# EAGLE schematic signal_processing_module (EAGLE 9.6.2)
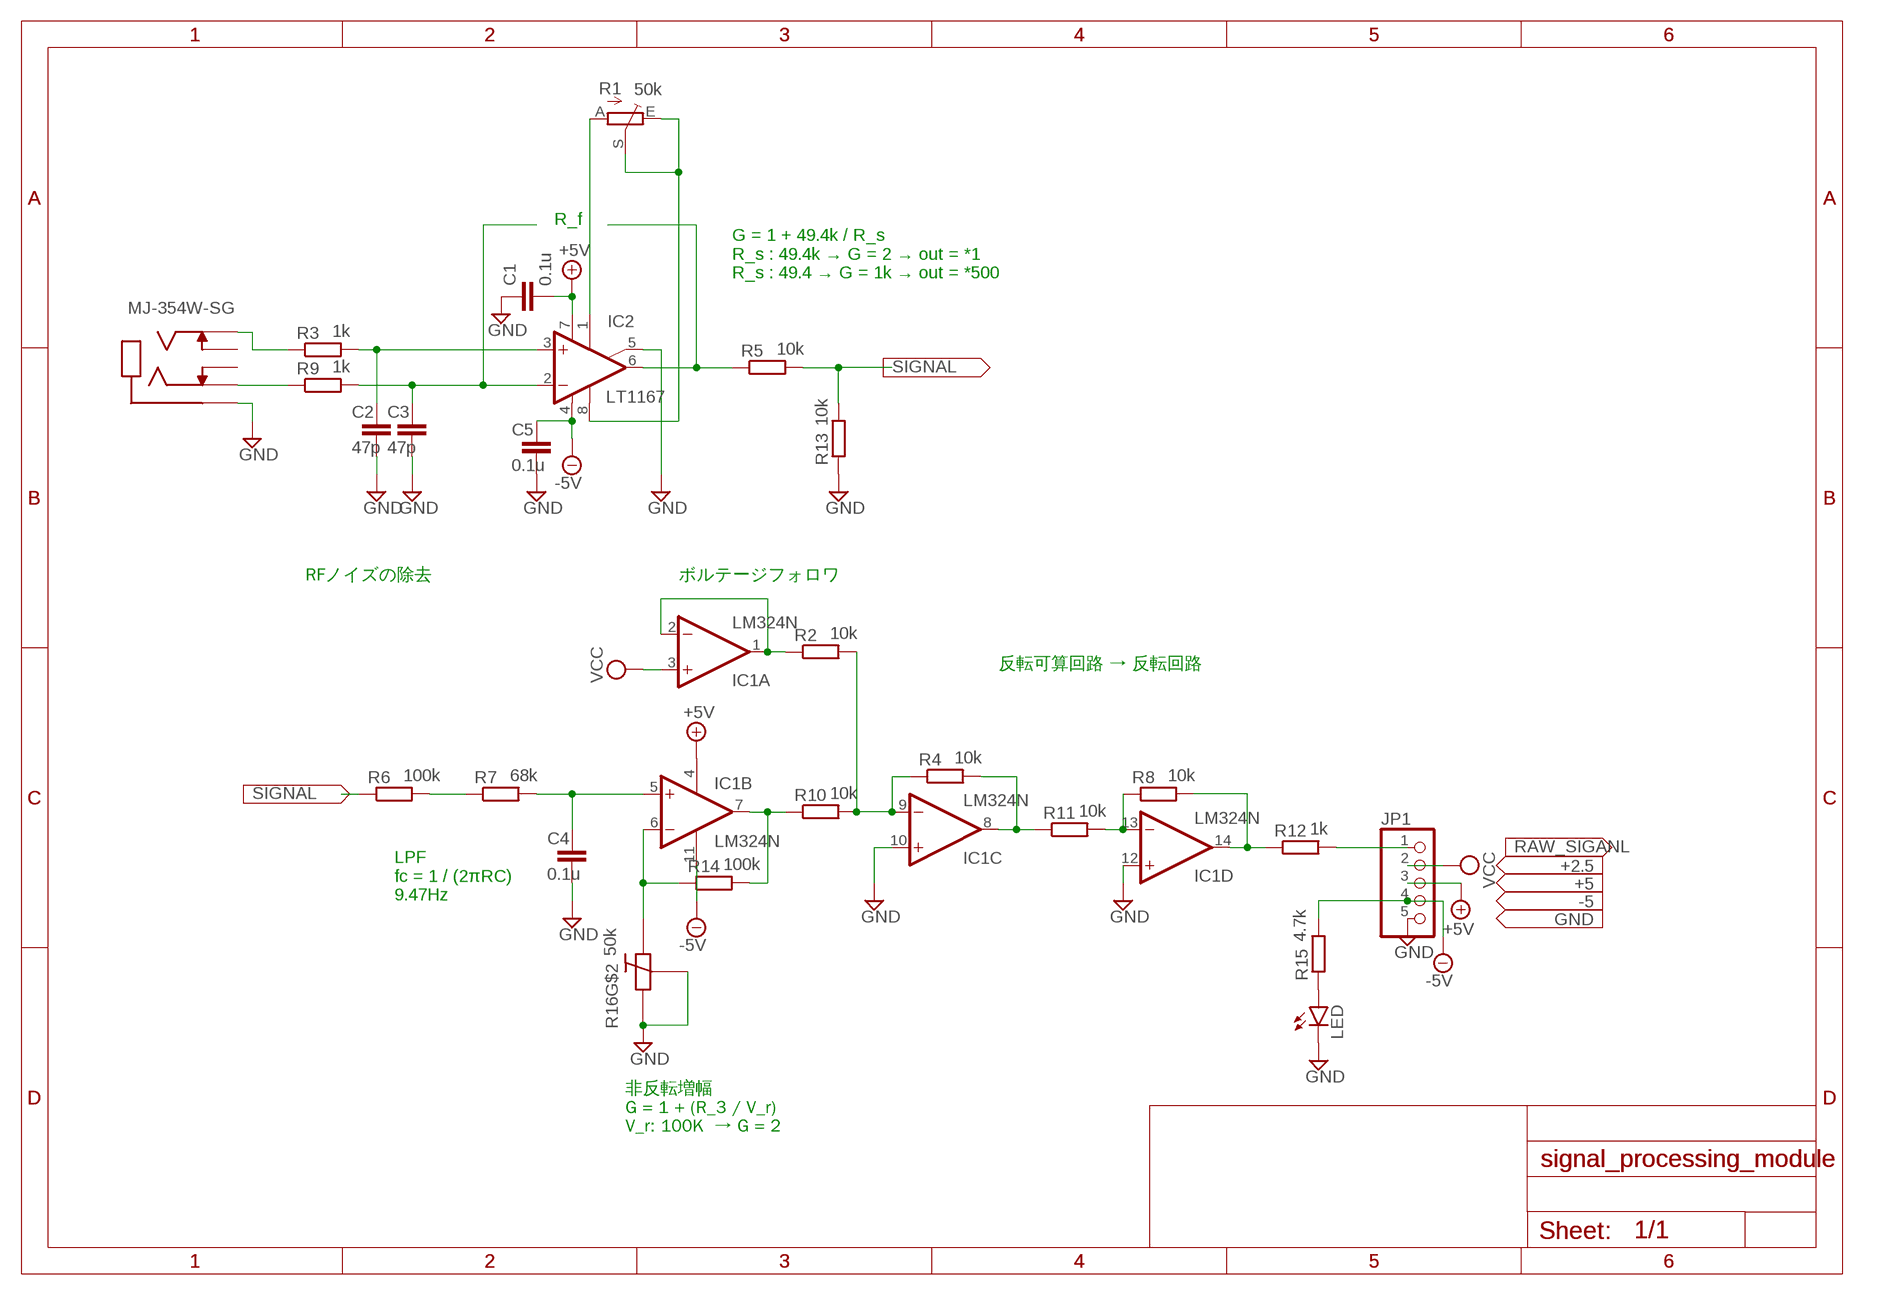
[diagram p0: schematic, sheet 1]

## Parts
C1  0.1u  C-EU025-024X044  [C025-024X044]
C2  47p  C-EU025-024X044  [C025-024X044]
C3  47p  C-EU025-024X044  [C025-024X044]
C4  0.1u  C-EU025-024X044  [C025-024X044]
C5  0.1u  C-EU025-024X044  [C025-024X044]
IC1  LM324N  [DIL14]
IC2  TL061P  [DIL08]
JP1  PINHD-1X5  [1X05]
LED  LED3MM  [LED3MM]
R1  50k  TRIM_EU-RS3  [RS3]
R2  10k  R-EU_0204/7  [0204/7]
R3  1k  R-EU_0204/7  [0204/7]
R4  10k  R-EU_0204/7  [0204/7]
R5  10k  R-EU_0204/7  [0204/7]
R6  100k  R-EU_0204/7  [0204/7]
R7  68k  R-EU_0204/7  [0204/7]
R8  10k  R-EU_0204/7  [0204/7]
R9  1k  R-EU_0204/7  [0204/7]
R10  10k  R-EU_0204/7  [0204/7]
R11  10k  R-EU_0204/7  [0204/7]
R12  1k  R-EU_0204/7  [0204/7]
R13  10k  R-EU_0204/7  [0204/7]
R14  100k  R-EU_0204/7  [0204/7]
R15  4.7k  R-EU_0204/7  [0204/7]
R16  50k  VR_2CH  [2CH_VR]
U$1  MJ-354W-SG-NEW  [MJ-354W-SG]

## Nets
+5V: C1.2 IC1.4(P:V+) IC2.7(V+) JP1.3
-5V: C5.1 IC1.11(P:V-) IC2.4(V-) JP1.4 R15.2
GND: C1.1 C2.2 C3.2 C4.2 C5.2 IC1.10(C:+IN) IC1.12(D:+IN) IC2.5(ON2) JP1.5 LED.K(C) R13.1 R16.P$4 R16.P$5 U$1.P$1
N$1: R9.1 U$1.P$2
N$2: R3.1 U$1.P$4
N$3: C2.1 IC2.3(+IN) R3.2
N$4: C3.1 IC2.2(-IN) R9.2
N$5: IC2.8(OPT) R1.E R1.S
N$6: IC2.6(OUT) R5.1
N$7: IC2.1(ON1) R1.A
N$8: R6.2 R7.1
N$9: IC1.13(D:-IN) R8.1 R11.2
N$10: JP1.1 R12.2
N$11: LED.A R15.1
N$12: IC1.6(B:-IN) R14.1 R16.P$6
N$13: IC1.8(C:OUT) R4.2 R11.1
N$14: IC1.14(D:OUT) R8.2 R12.1
N$15: C4.1 IC1.5(B:+IN) R7.2
N$16: R5.2 R13.2
N$17: R6.1
N$18: IC1.1(A:OUT) IC1.2(A:-IN) R2.1
N$21: IC1.9(C:-IN) R2.2 R4.1 R10.2
RAW_SIGNAL: IC1.7(B:OUT) R10.1 R14.2
VCC: IC1.3(A:+IN) JP1.2
Unconnected: R16.P$1 R16.P$2 R16.P$3 U$1.P$3 U$1.P$5

## Notes on the sheet
- R_f
- G = 1 + 49.4k / R_s
  R_s : 49.4k → G = 2 → out = *1
  R_s : 49.4 → G = 1k → out = *500
- MJ-354W-SG
- LT1167
- RFノイズの除去 | ボルテージフォロワ
- 反転可算回路 → 反転回路
- LPF
  fc = 1 / (2πRC)
  9.47Hz
- 非反転増幅
  G = 1 + (R_3 / V_r)
  V_r: 100K  → G = 2

## Library data of the parts
C1-C5 = rcl:C-EU: CAPACITOR, European symbol; SPICEPREFIX: C
IC1 = linear:LM324: OP AMP
IC2 = linear:TL061: OP AMP
JP1 = pinhead:PINHD-1X5: PIN HEADER
LED = led:LED: LED OSRAM: - CHIPLED LG R971, LG N971, LY N971, LG Q971, LY Q971, LO R971, LY R971 LH N974, LH R974 LS Q976, LO Q976, LY Q976 LO Q996 - Hyper CHIPLED LW Q18S LB Q993, LB Q99A, LB R99A - SideLED LS A670, LO A670, LY A670, LG A670, LP A670 LB A673, LV A673, LT A673, LW A673 LH A674 LY A675 LS A676, LA A676, LO A676, LY A676, LW A676 LS A679, LY A679, LG A679 - Hyper Micro SIDELED® LS Y876, LA Y876, LO Y876, LY Y876 LT Y87S - SmartLED LW L88C, LW L88S LB L89C, LB L89S, LG L890 LS L89K, LO L89K, LY L89K LS L896, LA L896, LO L896, LY L896 - TOPLED LS T670, LO T670, LY T670, LG T670, LP T670 LSG T670, LSP T670, LSY T670, LOP T670, LYG T670 LG T671, LOG T671, LSG T671 LB T673, LV T673, LT T673, LW T673 LH T674 LS T676, LA T676, LO T676, LY T676, LB T676, LH T676, LSB T676, LW T676 LB T67C, LV T67C, LT T67C, LS T67K, LO T67K, LY T67K, LW E67C LS E67B, LA E67B, LO E67B, LY E67B, LB E67C, LV E67C, LT E67C LW T67C LS T679, LY T679, LG T679 LS T770, LO T770, LY T770, LG T770, LP T770 LB T773, LV T773, LT T773, LW T773 LH T774 LS E675, LA E675, LY E675, LS T675 LS T776, LA T776, LO T776, LY T776, LB T776 LHGB T686 LT T68C, LB T68C - Hyper Mini TOPLED® LB M676 - Mini TOPLED Santana® LG M470 LS M47K, LO M47K, LY M47K Source: http://www.osram.convergy.de LUXEON: - LUMILED® LXK2-PW12-R00, LXK2-PW12-S00, LXK2-PW14-U00, LXK2-PW14-V00 LXK2-PM12-R00, LXK2-PM12-S00, LXK2-PM14-U00 LXK2-PE12-Q00, LXK2-PE12-R00, LXK2-PE12-S00, LXK2-PE14-T00, LXK2-PE14-U00 LXK2-PB12-K00, LXK2-PB12-L00, LXK2-PB12-M00, LXK2-PB14-N00, LXK2-PB14-P00, LXK2-PB14-Q00 LXK2-PR12-L00, LXK2-PR12-M00, LXK2-PR14-Q00, LXK2-PR14-R00 LXK2-PD12-Q00, LXK2-PD12-R00, LXK2-PD12-S00 LXK2-PH12-R00, LXK2-PH12-S00 LXK2-PL12-P00, LXK2-PL12-Q00, LXK2-PL12-R00 Source: www.luxeon.com KINGBRIGHT: KA-3528ASYC Source: www.kingbright.com
R1 = pot:TRIM_EU-: POTENTIOMETER
R2-R15 = rcl:R-EU_: RESISTOR, European symbol; SPICEPREFIX: R
R16 = myparts:VR_2CH
U$1 = myparts:MJ-354W-SG-NEW

## Net classes
0 default: width 1.27 mm, clearance 0.381 mm